# EAGLE schematic Zes (EAGLE 8.4.0)
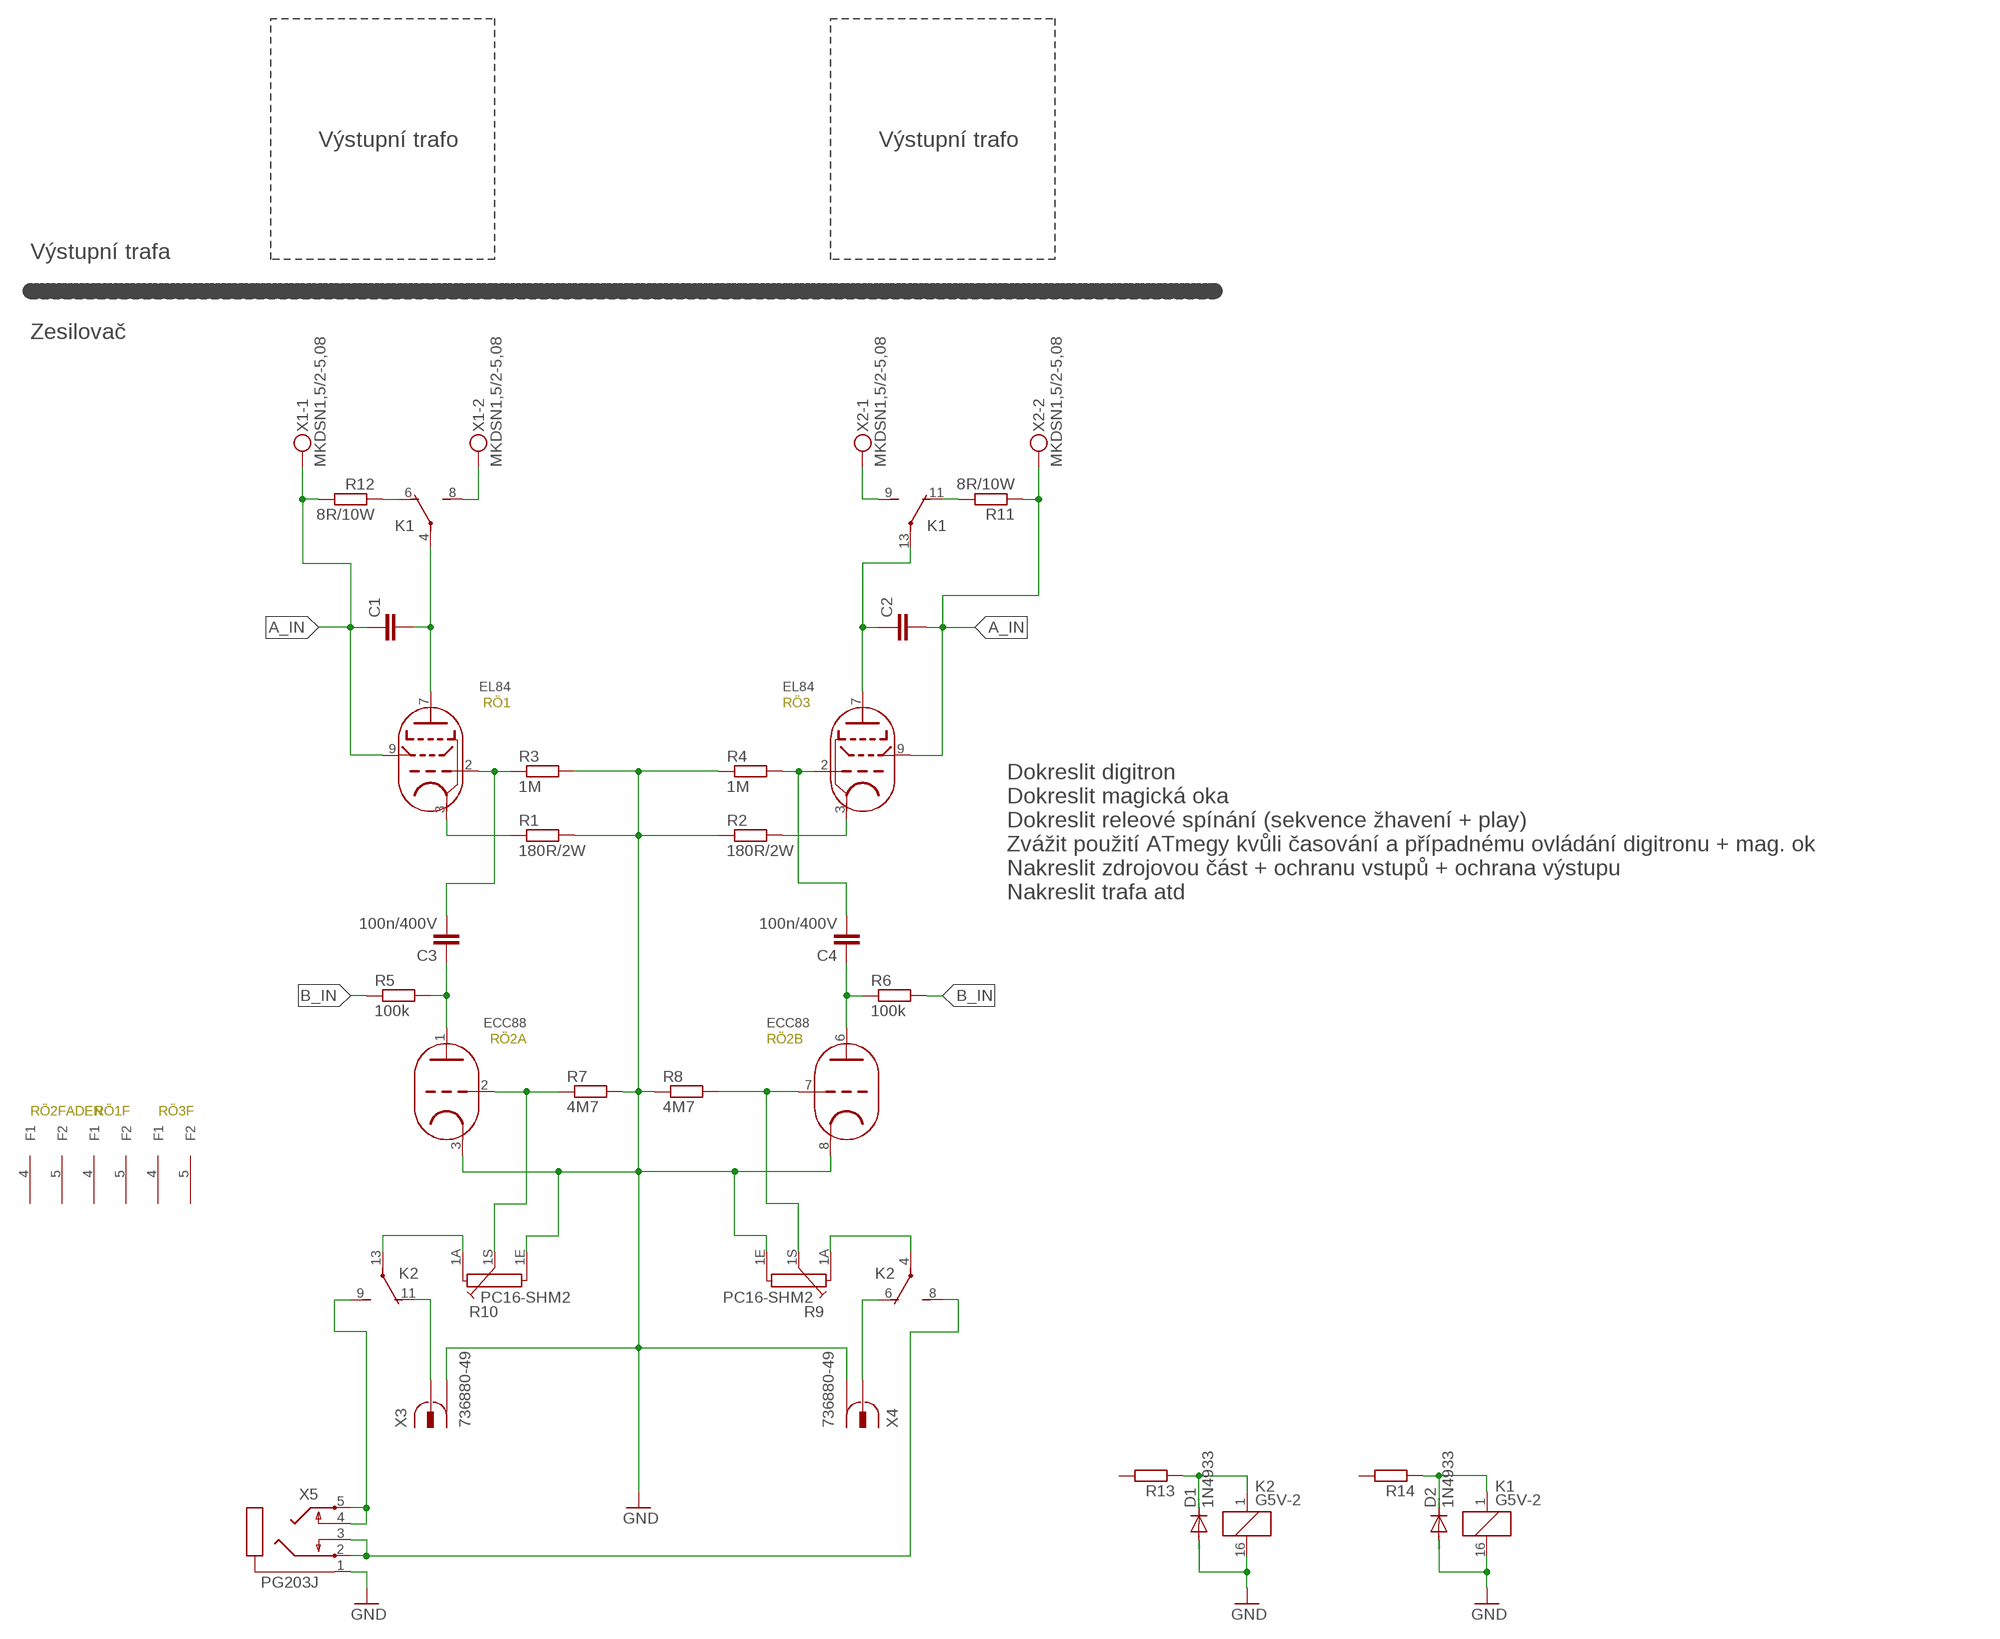
[diagram p0: schematic, sheet 1]

## Parts
C1  C15/8  [C15B8]
C2  C15/8  [C15B8]
C3  100n/400V  C15/8  [C15B8]
C4  100n/400V  C15/8  [C15B8]
D1  1N4933  [DO41-10]
D2  1N4933  [DO41-10]
K1  G5V-2  [G5V-2]
K2  G5V-2  [G5V-2]
R1  180R/2W  R-EU_0309/12  [0309/12]
R2  180R/2W  R-EU_0309/12  [0309/12]
R3  1M  R-EU_0309/12  [0309/12]
R4  1M  R-EU_0309/12  [0309/12]
R5  100k  R-EU_0309/12  [0309/12]
R6  100k  R-EU_0309/12  [0309/12]
R7  4M7  R-EU_0309/12  [0309/12]
R8  4M7  R-EU_0309/12  [0309/12]
R9  PC16-SHM2  [PC16-SHM2]
R10  PC16-SHM2  [PC16-SHM2]
R11  8R/10W  R-EU_VTA52  [VTA52]
R12  8R/10W  R-EU_VTA52  [VTA52]
R13  R-EU_0207/10  [0207/10]
R14  R-EU_0207/10  [0207/10]
RÖ1  EL84  [NOVAL_P]
RÖ2  ECC88  [NOVAL_P]
RÖ3  EL84  [NOVAL_P]
X1  MKDSN1,5/2-5,08  [MKDSN1,5/2-5,08]
X2  MKDSN1,5/2-5,08  [MKDSN1,5/2-5,08]
X3  736880-49  [736880-49]
X4  736880-49  [736880-49]
X5  PG203J  [PG203J]

## Nets
A_IN: C1.1 C2.1 C2.2 K1.13(2:P) R11.1 R12.2 RÖ1.9(G2) RÖ3.7(A) RÖ3.9(G2) X1.1 X2.2
B_IN: R5.1 R6.2
GND: D1.A D2.A K1.16 K2.16 R1.2 R2.1 R3.2 R4.1 R7.2 R8.1 R9.1E R10.1E RÖ2.3(A:K) RÖ2.8(B:K) X3.1 X3.1@1 X3.1@2 X4.1 X4.1@1 X4.1@2 X5.1
N$1: K1.11(2:O) R11.2
N$2: K2.9(2:S) X5.4 X5.5
N$3: K2.8(1:S) X5.2 X5.3
N$4: C1.2 K1.4(1:P) RÖ1.7(A)
N$5: K1.6(1:O) R12.1
N$6: K1.9(2:S) X2.1
N$7: R1.1 RÖ1.3(K_G3)
N$8: C3.2 R3.1 RÖ1.2(G1)
N$9: R7.1 R10.1S RÖ2.2(A:G)
N$10: R8.2 R9.1S RÖ2.7(B:G)
N$11: C4.2 R4.2 RÖ3.2(G1)
N$12: R2.2 RÖ3.3(K_G3)
N$13: C3.1 R5.2 RÖ2.1(A:A)
N$14: C4.1 R6.1 RÖ2.6(B:A)
N$15: K1.8(1:S) X1.2
N$16: K2.13(2:P) R10.1A
N$17: K2.4(1:P) R9.1A
N$18: K2.11(2:O) X3.2
N$19: K2.6(1:O) X4.2
N$22: D1.C K2.1 R13.1
N$23: D2.C K1.1 R14.1
Unconnected: R9.M1 R9.M2 R9.M3 R9.M4 R10.M1 R10.M2 R10.M3 R10.M4 R13.2 R14.2

## Notes on the sheet
- Výstupní trafo | Výstupní trafo
- Výstupní trafa
- Zesilovač
- Dokreslit digitron
  Dokreslit magická oka
  Dokreslit releové spínání (sekvence žhavení + play)
  Zvážit použití ATmegy kvůli časování a případnému ovládání digitronu + mag. ok
  Nakreslit zdrojovou část + ochranu vstupů + ochrana výstupu
  Nakreslit trafa atd

## Power pins joined to a net without a drawn wire
F1: RÖ1.4(F1) RÖ2.4(FADEN:F1) RÖ3.4(F1)
F2: RÖ1.5(F2) RÖ2.5(FADEN:F2) RÖ3.5(F2)

## Library data of the parts
C1-C4 = capacitor-wima:C: CAPACITOR naming: grid - package width
D1 D2 = diode:1N4933: DIODE fast recovery rectifier, 1A
K1 K2 = relay:G5V-2: OMRON PCB Relay Source: http://www.omron.com/ecb/products/pdf/en-g5v2.pdf; MPN: G5V-2 5DC; OC_FARNELL: 9949488; OC_NEWARK: 78K5703
R1-R8 = resistor:R-EU_: RESISTOR, European symbol
R9 R10 = piher:PC16-SHM2: POTENTIOMETER single carbon potentiometer, 16 mm, S3ROH; OC_FARNELL: unknown; OC_NEWARK: unknown
R11-R14 = rcl:R-EU_: RESISTOR, European symbol; SPICEPREFIX: R
RÖ1 RÖ3 = EL84:EL84
RÖ2 = E88CC:ECC88
X1 X2 = con-phoenix-508:MKDSN1,5/2-5,08: MKDSN 1,5/ 2-5,08 Printklemme Nennstrom: 13,5 A Nennspannung: 250 V Rastermaß: 5,08 mm Polzahl: 2 Anschlussart: Schraubanschluss Montage: Löten Anschlussrichtung Leiter/Platine: 0 ° Artikelnummer: 1729128 Source: http://eshop.phoenixcontact.com .. 1729128.pdf
X3 X4 = con-conrad:736880-49: Cinch Connector ( RCA Jack ) Cinch-Einbaukupplung 90º 72345 Vernickelt BKL Electronic Source: Conrad <http://www.conrad.de/ce/de/product/736880>
X5 = con-hirschmann:PG203J: MIC/HEADPHONE JACK KS-S stereo microphone/headphone jack PG203JN (Schukat); OC_FARNELL: unknown; OC_NEWARK: unknown